# EAGLE design D:A shield (EAGLE 6.4)
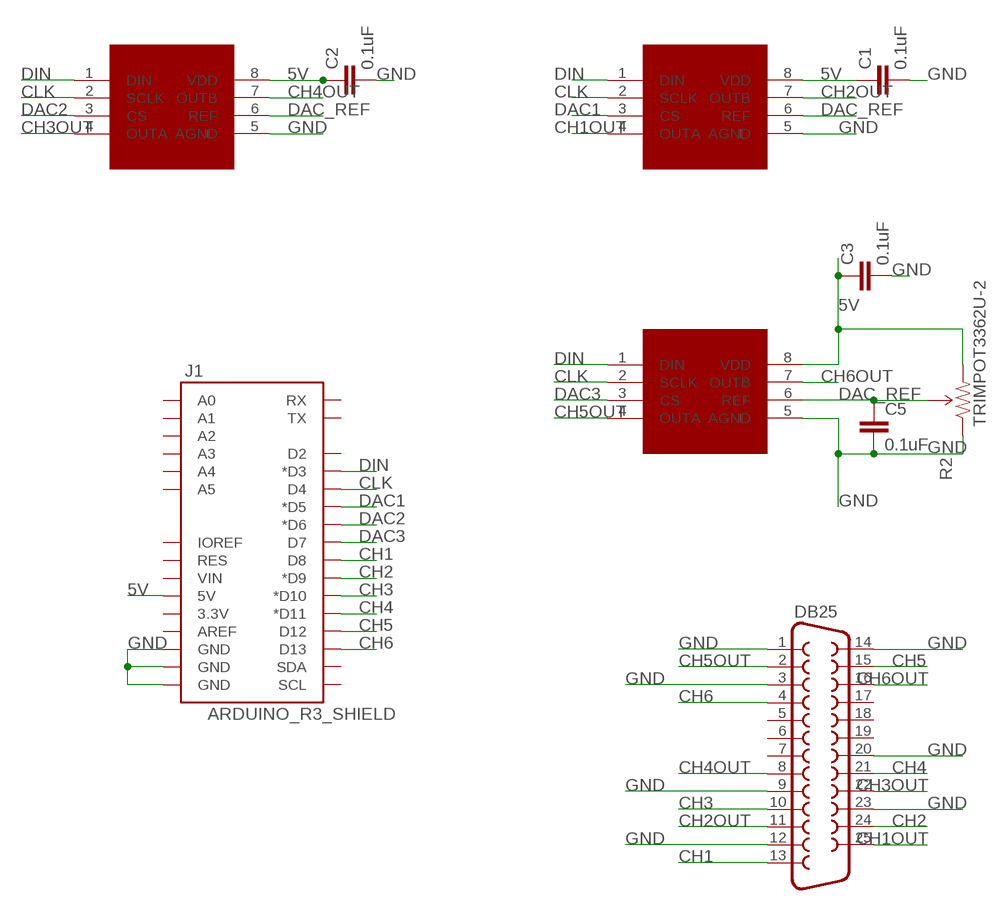
[diagram p0: schematic, sheet 1]

## Parts
C1  0.1uF  CAP1206  [1206]
C2  0.1uF  CAP1206  [1206]
C3  0.1uF  CAP1206  [1206]
C5  0.1uF  CAP1206  [1206]
DAC1  TLV5618  [DIL08]
DAC2  TLV5618  [DIL08]
DAC3  TLV5618  [DIL08]
DB25  F25HP  [F25HP]
J1  ARDUINO_R3_SHIELD  [UNO_R3_SHIELD]
R2  TRIMPOT3362U-2  [3362U-2]

## Nets
5V: C1.1 C2.1 C3.1 DAC1.8(VDD) DAC2.8(VDD) DAC3.8(VDD) J1.5V R2.3(CW)
CH1: DB25.13 J1.D8
CH1OUT: DAC1.4(OUTA) DB25.25
CH2: DB25.24 J1.D9(*D9)
CH2OUT: DAC1.7(OUTB) DB25.11
CH3: DB25.10 J1.D10(*D10)
CH3OUT: DAC3.4(OUTA) DB25.22
CH4: DB25.21 J1.D11(*D11)
CH4OUT: DAC3.7(OUTB) DB25.8
CH5: DB25.15 J1.D12
CH5OUT: DAC2.4(OUTA) DB25.2
CH6: DB25.4 J1.D13
CH6OUT: DAC2.7(OUTB) DB25.16
CLK: DAC1.2(SCLK) DAC2.2(SCLK) DAC3.2(SCLK) J1.D4
DAC1: DAC1.3(CS) J1.D5(*D5)
DAC2: DAC3.3(CS) J1.D6(*D6)
DAC3: DAC2.3(CS) J1.D7
DAC_REF: C5.1 DAC1.6(REF) DAC2.6(REF) DAC3.6(REF) R2.2(WIPER)
DIN: DAC1.1(DIN) DAC2.1(DIN) DAC3.1(DIN) J1.D3(*D3)
GND: C1.2 C2.2 C3.2 C5.2 DAC1.5(AGND) DAC2.5(AGND) DAC3.5(AGND) DB25.1 DB25.3 DB25.9 DB25.12 DB25.14 DB25.20 DB25.23 J1.GND@0(GND) J1.GND@1(GND) J1.GND@2(GND) R2.1(CCW)
Unconnected: DB25.5 DB25.6 DB25.7 DB25.17 DB25.18 DB25.19 J1.3.3V J1.A0 J1.A1 J1.A2 J1.A3 J1.A4 J1.A5 J1.AREF J1.D2 J1.IOREF J1.RES J1.RX J1.SCL J1.SDA J1.TX J1.VIN

## Library data of the parts
C1-C3 C5 = SparkFun:CAP: Capacitor Standard 0603 ceramic capacitor, and 0.1" leaded capacitor.
DAC1-DAC3 = winfree_works:TLV5618
DB25 = SparkFun-Connectors:F25: 25 Pin male connector. PCB edge mount for regular PCB thicknesses. This connector will connect directly to the back of a PC parallel port or through a normal DB25 extension cable (M/F). SKU: PRT-08287
J1 = SparkFun-Boards:ARDUINO_R3_SHIELD: Shield form compatible with the Arduino Uno R3.
R2 = SparkFun-Electromechanical:TRIMPOT: Various small potentiometers for "set-and-forget" applications

## Board
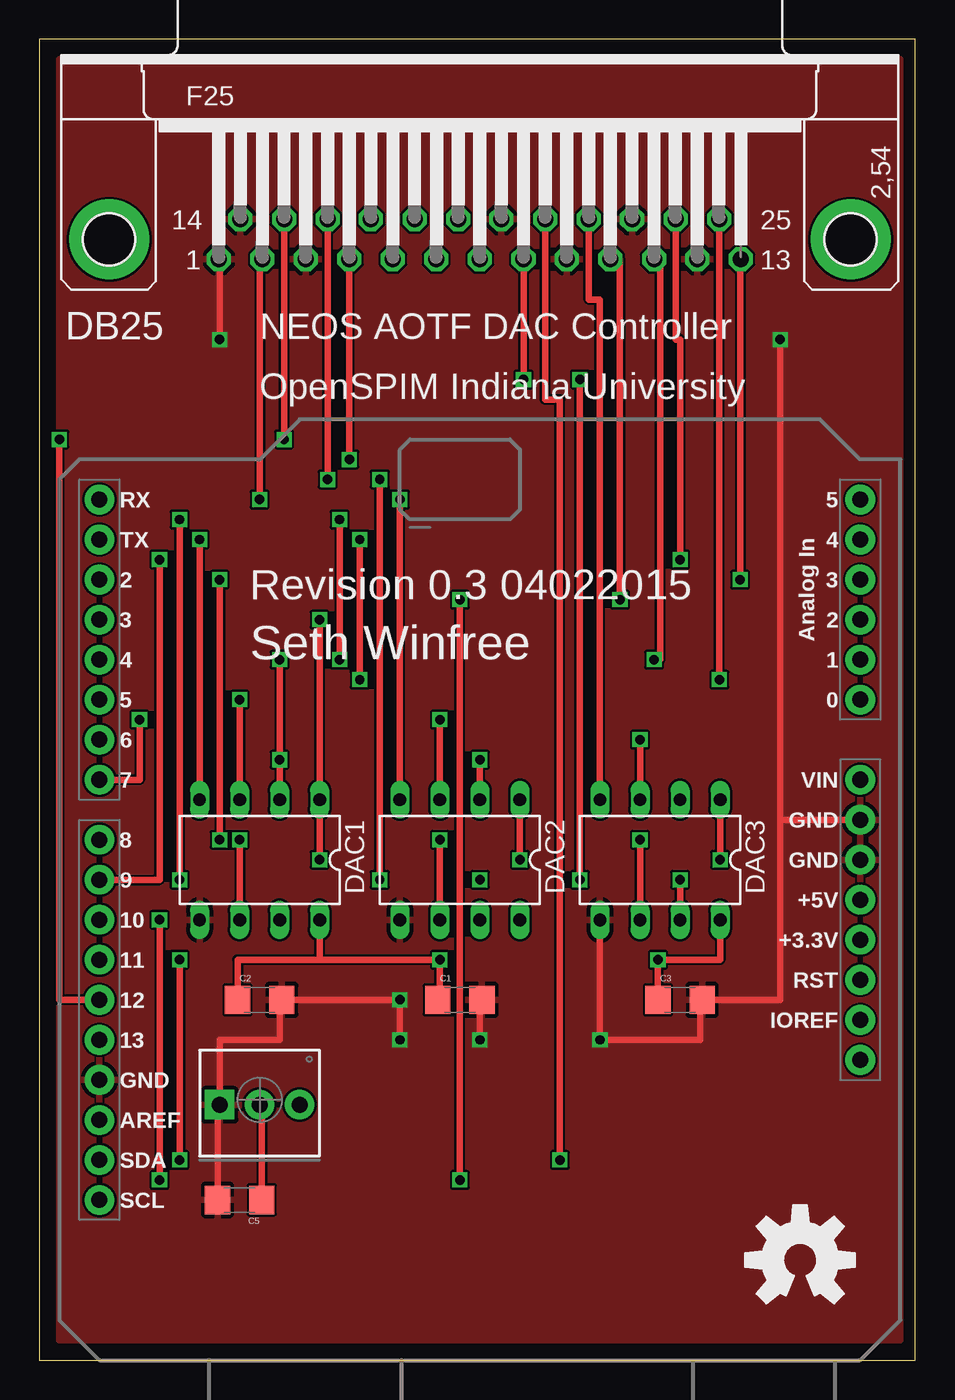
[diagram p1: board, top side]
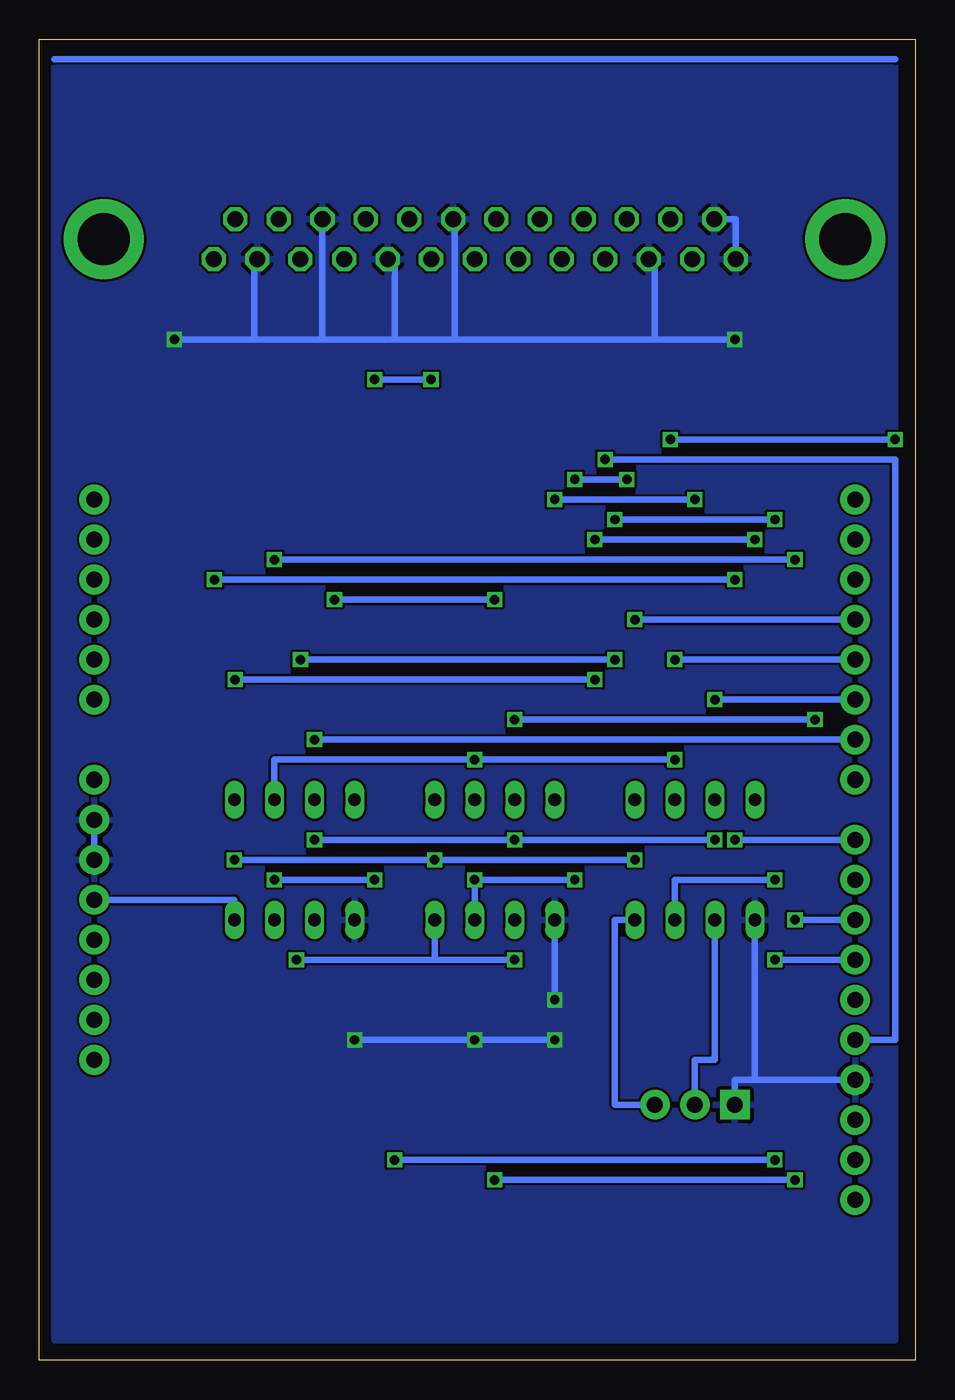
[diagram p2: board, bottom side, seen from below]

Size 55.55 x 83.81 mm. Coordinates in mm from the lower left corner, seen from the top.
Outline: 0,0 55.55,0 55.55,83.81 0,83.81 0,0
Copper layers (1*16): Top 0.0356mm / dielectric 1.5011mm / Bottom 0.0356mm
Design rules "LaenPCBOrder": minimum track width 6mil, minimum drill 13mil, track to track 6mil, track to pad 6mil, pad to pad 6mil, via to via 6mil, smd to smd 6mil, copper to edge 15mil, drill to drill 6mil, minimum pad ring 7mil, minimum via ring 7mil, stop-mask expansion 4mil, vias tented up to drill 0mil, thermal gap 10mil

### Footprints (pad centres in the part's own frame; a part is rotated, then mirrored left to right if it is on the bottom)
1206 = smd 1.6 x 1.8: 1 -1.4,0; 2 1.4,0
DIL08 = drill 0.813 long: 1 -3.81,-3.81; 2 -1.27,-3.81; 3 1.27,-3.81; 4 3.81,-3.81; 5 3.81,3.81; 6 1.27,3.81; 7 -1.27,3.81; 8 -3.81,3.81
F25HP = drill 1.016 octagon: 1 -16.561,-1.27; 2 -13.792,-1.27; 3 -11.049,-1.27; 4 -8.28,-1.27; 5 -5.512,-1.27; 6 -2.769,-1.27; 7 0,-1.27; 8 2.769,-1.27; 9 5.512,-1.27; 10 8.28,-1.27; 11 11.049,-1.27; 12 13.792,-1.27; 13 16.561,-1.27; 14 -15.189,1.27; 15 -12.421,1.27; 16 -9.652,1.27; 17 -6.909,1.27; 18 -4.14,1.27; 19 -1.372,1.27; 20 1.372,1.27; 21 4.14,1.27; 22 6.909,1.27; 23 9.652,1.27; 24 12.421,1.27; 25 15.189,1.27 | drill 3.302 pad 5.08: G1 -23.52,0; G2 23.52,0
UNO_R3_SHIELD = drill 1.016 pad 1.88: 3.3V 50.8,26.67; 5V 50.8,29.21; A0 50.8,41.91; A1 50.8,44.45; A2 50.8,46.99; A3 50.8,49.53; A4 50.8,52.07; A5 50.8,54.61; AREF 2.54,15.24; D2 2.54,49.53; D3 2.54,46.99; D4 2.54,44.45; D5 2.54,41.91; D6 2.54,39.37; D7 2.54,36.83; D8 2.54,33.02; D9 2.54,30.48; D10 2.54,27.94; D11 2.54,25.4; D12 2.54,22.86; D13 2.54,20.32; GND@0 50.8,31.75; GND@1 50.8,34.29; GND@2 2.54,17.78; IOREF 50.8,21.59; NC 50.8,19.05; RES 50.8,24.13; RX 2.54,54.61; SCL 2.54,10.16; SDA 2.54,12.7; TX 2.54,52.07; VIN 50.8,36.83
3362U-2 = drill 1.016 pad 1.88 square: 1 -2.54,-0.305 | drill 1.016 pad 1.88: 2 0,-0.305; 3 2.54,-0.305

### Placement (x,y rotation side)
C1  26.67,22.86 0 top
C2  13.97,22.86 0 top
C3  40.64,22.86 0 top
C5  12.7,10.16 180 top
DAC1  13.97,31.75 180 top
DAC2  26.67,31.75 180 top
DAC3  39.37,31.75 180 top
DB25  27.94,71.12 0 top
J1  1.27,0 0 top
R2  13.97,16.51 0 top
U$1  [OSHW-LOGO-L]  48.26,6.35 0 top

### Tracks (layer width: path | path; a pad name or v marks a point on that pad's centre or on a via)
5V  (via drill 0.6)
  Top 0.406: 17.78,25.4 12.57,25.4 C2.1 | DAC3.8 43.18,25.4 v39.24,25.4 C3.1 | C1.1 25.4,22.86 v25.4,25.4 17.78,25.4 | 17.78,25.4 DAC1.8
  Bottom 0.406: R2.3 19.05,16.2 19.05,27.94 DAC1.8 | v25.4,25.4 30.48,25.4 | 30.48,25.4 DAC2.8 | 30.48,25.4 v39.24,25.4 | J1.5V 43.18,29.21 DAC3.8
CH1  (via drill 0.6)
  Top 0.406: DB25.13 44.45,69.85 v44.45,49.53 | v11.43,49.53 v11.43,33.02
  Bottom 0.406: v44.45,49.53 v11.43,49.53 | v11.43,33.02 J1.D8
CH1OUT  (via drill 0.6)
  Top 0.406: DAC1.4 v10.16,52.07 | v20.32,52.07 v20.32,43.18 | v43.13,43.18 DB25.25
  Bottom 0.406: v10.16,52.07 v20.32,52.07 | v20.32,43.18 v43.13,43.18
CH2  (via drill 0.6)
  Top 0.406: v40.64,50.8 40.64,64.77 40.36,64.77 DB25.24 | J1.D9 7.62,30.48 v7.62,50.8
  Bottom 0.406: v7.62,50.8 v40.64,50.8
CH2OUT  (via drill 0.6)
  Top 0.406: v8.89,30.48 v8.89,53.34 | v19.05,53.34 v19.05,44.45 | v38.99,44.45 39.37,44.45 39.37,69.85 DB25.11
  Bottom 0.406: v8.89,53.34 v19.05,53.34 | v19.05,44.45 v38.99,44.45 | v8.89,30.48 15.24,30.48 DAC1.7
CH3  (via drill 0.6)
  Top 0.406: DB25.10 36.83,69.85 v36.83,48.26 | v7.62,27.94 v7.62,11.43 | v26.67,11.43 v26.67,48.26
  Bottom 0.406: v36.83,48.26 v26.67,48.26 | J1.D10 v7.62,27.94 | v7.62,11.43 v26.67,11.43
CH3OUT
  Top 0.406: DAC3.4 35.56,67.31 34.85,67.31 DB25.22
CH4  (via drill 0.6)
  Top 0.406: DB25.21 32.08,60.96 33.02,60.96 v33.02,12.7 | v8.89,25.4 v8.89,12.7
  Bottom 0.406: J1.D11 v8.89,25.4 | v8.89,12.7 v33.02,12.7
CH4OUT  (via drill 0.6)
  Top 0.406: v34.29,30.48 v34.29,62.23 | v30.71,62.23 DB25.8 | DAC3.7 v40.64,30.48
  Bottom 0.406: v40.64,30.48 v34.29,30.48 | v34.29,62.23 v30.71,62.23
CH5  (via drill 0.6)
  Top 0.406: J1.D12 1.27,22.86 v1.27,58.42 | v15.52,58.42 DB25.15
  Bottom 0.406: v1.27,58.42 v15.52,58.42
CH5OUT  (via drill 0.6)
  Top 0.406: DAC2.4 v22.86,54.61 | DB25.2 13.97,69.85 v13.97,54.61
  Bottom 0.406: v22.86,54.61 v13.97,54.61
CH6  (via drill 0.6)
  Top 0.406: v19.66,57.15 DB25.4
  Bottom 0.406: J1.D13 1.27,20.32 1.27,57.15 v19.66,57.15
CH6OUT  (via drill 0.6)
  Top 0.406: v21.59,30.48 v21.59,55.88 | v18.29,55.88 DB25.16
  Bottom 0.406: v21.59,30.48 v27.94,30.48 DAC2.7 | v21.59,55.88 v18.29,55.88
CLK  (via drill 0.6)
  Top 0.406: DAC2.2 v27.94,38.1 | DAC1.2 v15.24,38.1 v15.24,44.45
  Bottom 0.406: DAC3.2 40.64,38.1 v27.94,38.1 v15.24,38.1 | J1.D4 v15.24,44.45
DAC1  (via drill 0.6)
  Top 0.406: v12.7,41.91 DAC1.3
  Bottom 0.406: J1.D5 v12.7,41.91
DAC2  (via drill 0.6)
  Top 0.406: DAC3.3 v38.1,39.37
  Bottom 0.406: v38.1,39.37 J1.D6
DAC3  (via drill 0.6)
  Top 0.406: DAC2.3 v25.4,40.64 | v6.35,40.64 6.35,36.83 J1.D7
  Bottom 0.406: v25.4,40.64 v6.35,40.64
DAC_REF  (via drill 0.6)
  Top 0.406: R2.2 14.1,16.2 C5.1 | DAC3.6 v38.1,33.02 | DAC2.6 v25.4,33.02 | v12.7,33.02 DAC1.6
  Bottom 0.406: R2.2 13.97,19.05 12.7,19.05 DAC1.6 | v38.1,33.02 v25.4,33.02 v12.7,33.02
DIN  (via drill 0.6)
  Top 0.406: DAC3.1 v43.18,31.75 | DAC2.1 v30.48,31.75 | v17.78,31.75 DAC1.1 v17.78,46.99
  Bottom 0.406: v43.18,31.75 v30.48,31.75 v17.78,31.75 | v17.78,46.99 J1.D3
GND  (via drill 0.6)
  Top 0.406: C5.2 11.3,16.2 R2.1 11.43,20.32 15.24,20.32 15.24,22.86 C2.2 v22.86,22.86 v22.86,20.32 | DAC3.5 v35.56,20.32 41.91,20.32 41.91,22.86 C3.2 46.99,22.86 46.99,34.29 | C1.2 27.94,22.86 v27.94,20.32 | DB25.1 11.43,69.85 v11.43,64.77 | J1.GND@1 46.99,34.29 | 46.99,34.29 v46.99,64.77
  Bottom 0.406: J1.GND@1 J1.GND@0 | R2.1 11.43,17.78 J1.GND@2 10.16,17.78 DAC1.5 | v35.56,20.32 v27.94,20.32 v22.86,20.32 | v22.86,22.86 DAC2.5 | v11.43,64.77 16.51,64.77 | 16.51,64.77 29.21,64.77 | 29.21,64.77 33.02,64.77 | 37.59,64.77 41.91,64.77 | 41.91,64.77 v46.99,64.77 | DB25.3 16.51,69.85 16.51,64.77 | DB25.14 11.38,72.39 DB25.1 | DB25.20 29.21,72.39 29.21,64.77 | DB25.12 41.91,69.85 41.91,64.77 | DB25.9 33.02,69.85 33.02,64.77 | 33.02,64.77 37.59,64.77 | 37.59,64.77 DB25.23
  pour Top: 1.27,1.27 1.27,82.55 54.61,82.55 54.61,1.27
  pour Bottom: 1.27,1.27 1.27,82.55 54.61,82.55 54.61,1.27
N$3
  Bottom 0.406: 1.27,82.55 54.61,82.55

### Text on the board
tNames: NEOS AOTF DAC Controller | OpenSPIM Indiana University | Revision 0.3 04022015 | Seth Winfree